# EAGLE design TestAdapter_02 (EAGLE 9.4.2)

## Sheet 1 of 2
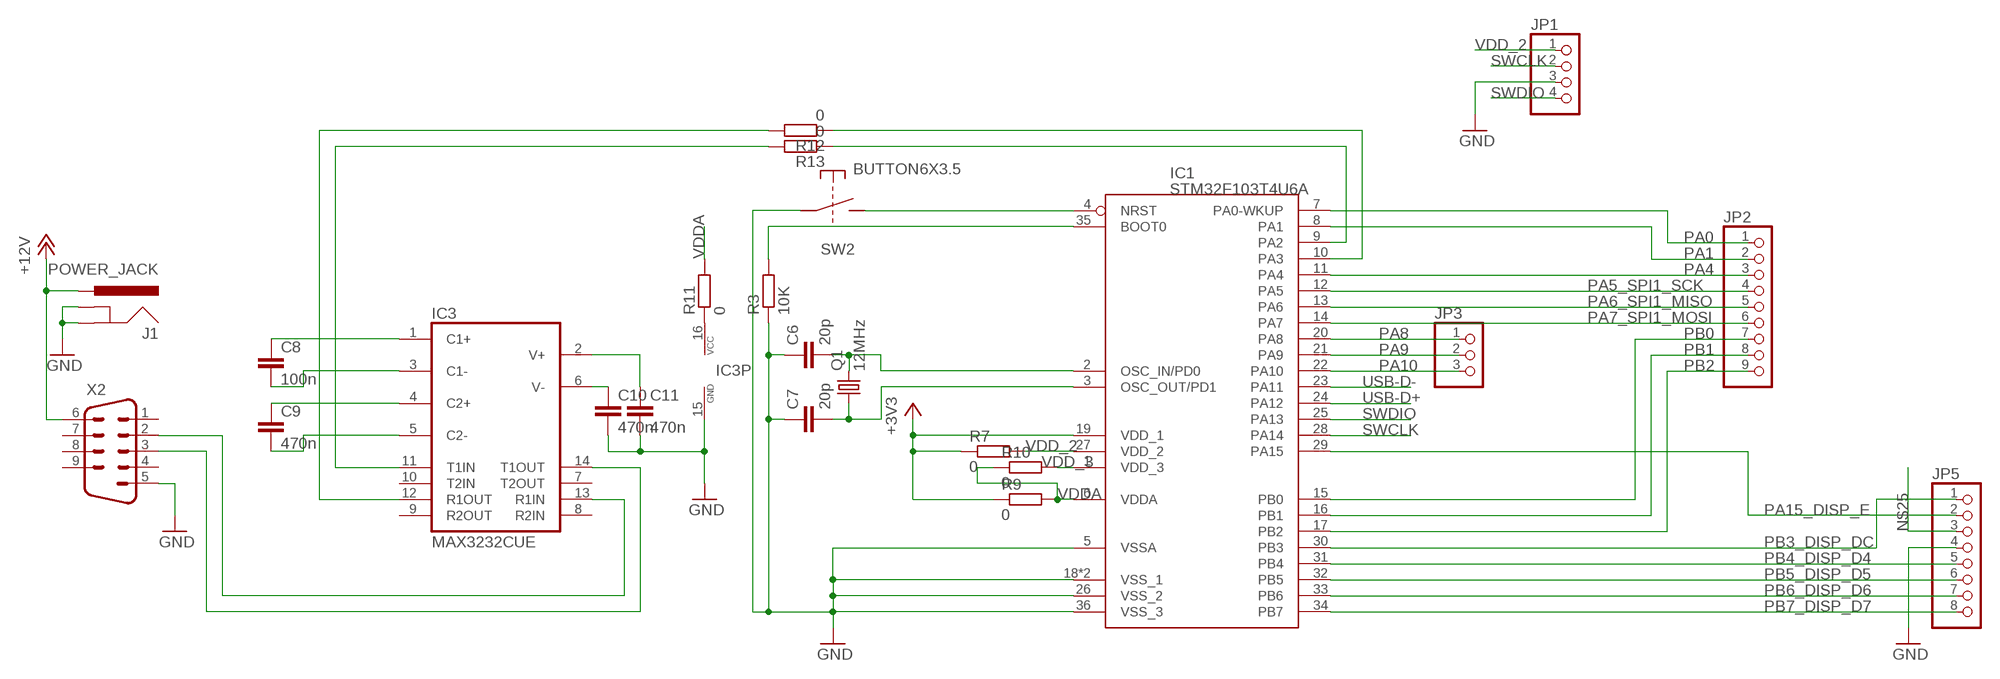
[diagram p0: schematic, sheet 1]

### Parts
C6  20p  CAP_0805  [CAP0805]
C7  20p  CAP_0805  [CAP0805]
C8  100n  CAP_0805  [CAP0805]
C9  470n  CAP_0805  [CAP0805]
C10  470n  CAP_0805  [CAP0805]
C11  470n  CAP_0805  [CAP0805]
IC1  STM32F103T4U6A  [QFN50P606X606X100-36]
IC3  MAX3232CUE  [TSSOP16]
J1  POWER_JACK  [POWER_JACK_PTH]
JP1  PINHD-1X4  [1X04]
JP2  PINHD-1X9  [1X09]
JP3  PINHD-1X3  [1X03]
JP5  PINHD-1X8  [1X08]
Q1  12MHz  CRYSTAL5032  [CRYSTAL-5025]
R3  10K  R_R0805  [RESC2012X50]
R7  0  R_R0805  [RESC2012X50]
R9  0  R_R0805  [RESC2012X50]
R10  0  R_R0805  [RESC2012X50]
R11  0  R_R0805  [RESC2012X50]
R12  0  R_R0805  [RESC2012X50]
R13  0  R_R0805  [RESC2012X50]
SW2  BUTTON6X3.5  [SW-6X3.5]
X2  M09-182  [182-009-MALE]

### Nets
+3V3: IC1.19(VDD_1) R7.1 R9.1 ; also sheet 2
+12V: J1.PWR X2.6
GND: C6.1 C7.1 C10.2 C11.2 IC1.5(VSSA) IC1.18(VSS_1) IC1.26(VSS_2) IC1.36(VSS_3) IC1.P$1(VSS_1) IC3.15(GND) J1.GND J1.GNDBREAK JP1.3 JP5.4 R3.1 SW2.1 X2.5 ; also sheet 2
N$2: C7.2 IC1.3(OSC_OUT/PD1) Q1.P$1
N$3: C6.2 IC1.2(OSC_IN/PD0) Q1.P$2
N$4: IC1.35(BOOT0) R3.2
N$5: IC1.4(NRST) SW2.2
N$6: IC3.16(VCC) R11.1
N$8: IC1.10(PA3) R12.1
N$9: IC1.9(PA2) R13.1
N$16: IC3.11(T1IN) R13.2
N$17: IC3.12(R1OUT) R12.2
N$25: JP5.3 ; also sheet 2
N$27: IC3.14(T1OUT) X2.3
N$28: IC3.13(R1IN) X2.2
N$29: C8.1 IC3.1(C1+)
N$30: C8.2 IC3.3(C1-)
N$31: C9.1 IC3.4(C2+)
N$32: C9.2 IC3.5(C2-)
N$33: C11.1 IC3.2(V+)
N$34: C10.1 IC3.6(V-)
PA0: IC1.7(PA0-WKUP) JP2.1
PA1: IC1.8(PA1) JP2.2
PA4: IC1.11(PA4) JP2.3
PA5_SPI1_SCK: IC1.12(PA5) JP2.4
PA6_SPI1_MISO: IC1.13(PA6) JP2.5
PA7_SPI1_MOSI: IC1.14(PA7) JP2.6
PA8: IC1.20(PA8) JP3.1
PA9: IC1.21(PA9) JP3.2
PA10: IC1.22(PA10) JP3.3
PA15_DISP_E: IC1.29(PA15) JP5.2
PB0: IC1.15(PB0) JP2.7
PB1: IC1.16(PB1) JP2.8
PB2: IC1.17(PB2) JP2.9
PB3_DISP_DC: IC1.30(PB3) JP5.1
PB4_DISP_D4: IC1.31(PB4) JP5.5
PB5_DISP_D5: IC1.32(PB5) JP5.6
PB6_DISP_D6: IC1.33(PB6) JP5.7
PB7_DISP_D7: IC1.34(PB7) JP5.8
SWCLK: IC1.28(PA14) JP1.2
SWDIO: IC1.25(PA13) JP1.4
USB-D+: IC1.24(PA12) ; also sheet 2
USB-D-: IC1.23(PA11) ; also sheet 2
VDD_2: IC1.27(VDD_2) JP1.1 R7.2 ; also sheet 2
VDD_3: IC1.1(VDD_3) R10.2 ; also sheet 2
VDDA: IC1.6(VDDA) R9.2 R10.1 R11.2
Unconnected: IC3.7(T2OUT) IC3.8(R2IN) IC3.9(R2OUT) IC3.10(T2IN) X2.1 X2.4 X2.7 X2.8 X2.9

## Sheet 2 of 2
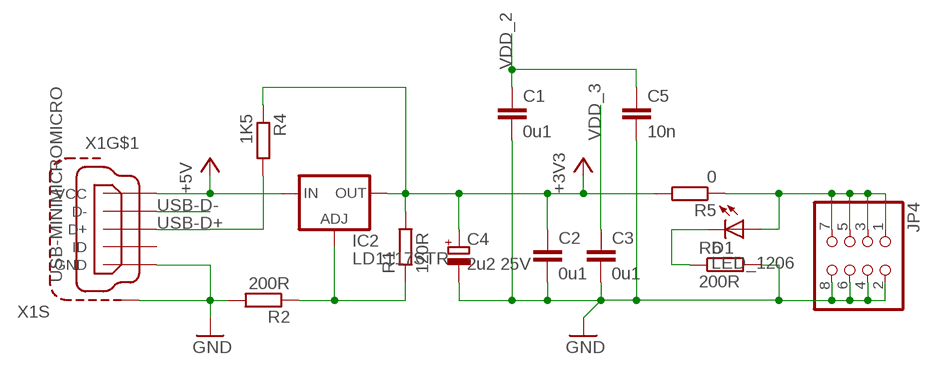
[diagram p1: schematic, sheet 2]

### Parts
C1  0u1  CAP_0805  [CAP0805]
C2  0u1  CAP_0805  [CAP0805]
C3  0u1  CAP_0805  [CAP0805]
C4  2u2 25V  CAP-POL_CAPE3216-A  [CAPMP3317X180]
C5  10n  CAP_0805  [CAP0805]
D1  LED_1206  [LED1206]
IC2  LD1117STR  VREG-ADJLD1117S  [SOT230P700X180-4]
JP4  PINHD-2X4  [2X04]
R1  120R  R_R0805  [RESC2012X50]
R2  200R  R_R0805  [RESC2012X50]
R4  1K5  R_R0805  [RESC2012X50]
R5  0  R_R0805  [RESC2012X50]
R6  200R  R_R0805  [RESC2012X50]
X1  USB-MINIMICROMICRO  [USB-B-MICRO-SMD]

### Nets
+3V3: C2.1 C4.1(+) IC2.2(OUT) IC2.4(OUT) R1.2 R4.1 R5.2 ; also sheet 1
+5V: IC2.3(IN) X1.VBUS(VCC)
GND: C1.2 C2.2 C3.2 C4.2(-) C5.2 JP4.2 JP4.4 JP4.6 JP4.8 R2.2 R6.2 X1.GND X1.SHIELD1(S:S1) X1.SHIELD2(S:S1) X1.SHIELD3(S:S1) ; also sheet 1
N$1: IC2.1(ADJ) R1.1 R2.1
N$25: D1.A JP4.1 JP4.3 JP4.5 JP4.7 R5.1 ; also sheet 1
N$26: D1.C R6.1
USB-D+: R4.2 X1.D+ ; also sheet 1
USB-D-: X1.D- ; also sheet 1
VDD_2: C1.1 C5.1 ; also sheet 1
VDD_3: C3.1 ; also sheet 1
Unconnected: X1.ID

## Library data of the parts
C1-C3 C5-C11 = Flamberm:CAP_
C4 = Flamberm:CAP-POL_
D1 = Flamberm:LED_
IC1 = Flamberm:STM32F103T4U6A
IC2 = Flamberm:VREG-ADJ: VOLTAGE REGULATOR
IC3 = maxim:MAX3232*: True RS-232 Transceivers 3.0V to 5.5V, Low-Power up to 1Mbps, Using Four 0.1µF External Capacitors Source: http://pdfserv.maxim-ic.com/en/ds/MAX3222-MAX3241.pdf; MF: MAXIM; MPN: MAX3232CUE+; OC_FARNELL: 1593350; OC_NEWARK: 68K4629
J1 = SparkFun-Connectors:POWER_JACK: Power Jack Connector This is the standard 5.5mm barrel jack for power. The PTH is the most common, proven, reliable, footprint. The Slot footprint only works if the mill layer is transmitted to the PCB fab house so be warned. Here are the connectors we sell at SparkFun: DC Barrel Power Jack/Connector <https://www.sparkfun.com/products/119> (PRT-00119) DC Barrel Power Jack/Connector (SMD) <https://www.sparkfun.com/products/12748> (PRT-12748) DC Barrel Jack Adapter - Breadboard Compatible <https://www.sparkfun.com/products/10811> (PRT-10811) It is used on this SparkFun product (and many, many others): SparkFun RedBoard - Programmed with Arduino <https://www.sparkfun.com/products/12757> (DEV-12757) Also, if you need a mating power supply or connector, please check these out: Wall Adapter Power Supply - 9VDC 650mA <https://www.sparkfun.com/products/298> (TOL-00298) DC Barrel Jack Adapter - Male <https://www.sparkfun.com/products/10287> (PRT-10287); PROD_ID: CONN-08197
JP1 = pinhead:PINHD-1X4: PIN HEADER
JP2 = pinhead:PINHD-1X9: PIN HEADER
JP3 = pinhead:PINHD-1X3: PIN HEADER
JP4 = pinhead:PINHD-2X4: PIN HEADER
JP5 = pinhead:PINHD-1X8: PIN HEADER
Q1 = Flamberm:CRYSTAL
R1-R7 R9-R13 = Flamberm:R_
SW2 = Flamberm:BUTTON
X1 = Flamberm:USB-MINIMICRO: MINI USB-B Conector Source: www.cypressindustries.com
X2 = con-subd:M09: SUB-D; OC_FARNELL: unknown; OC_NEWARK: unknown

## Board
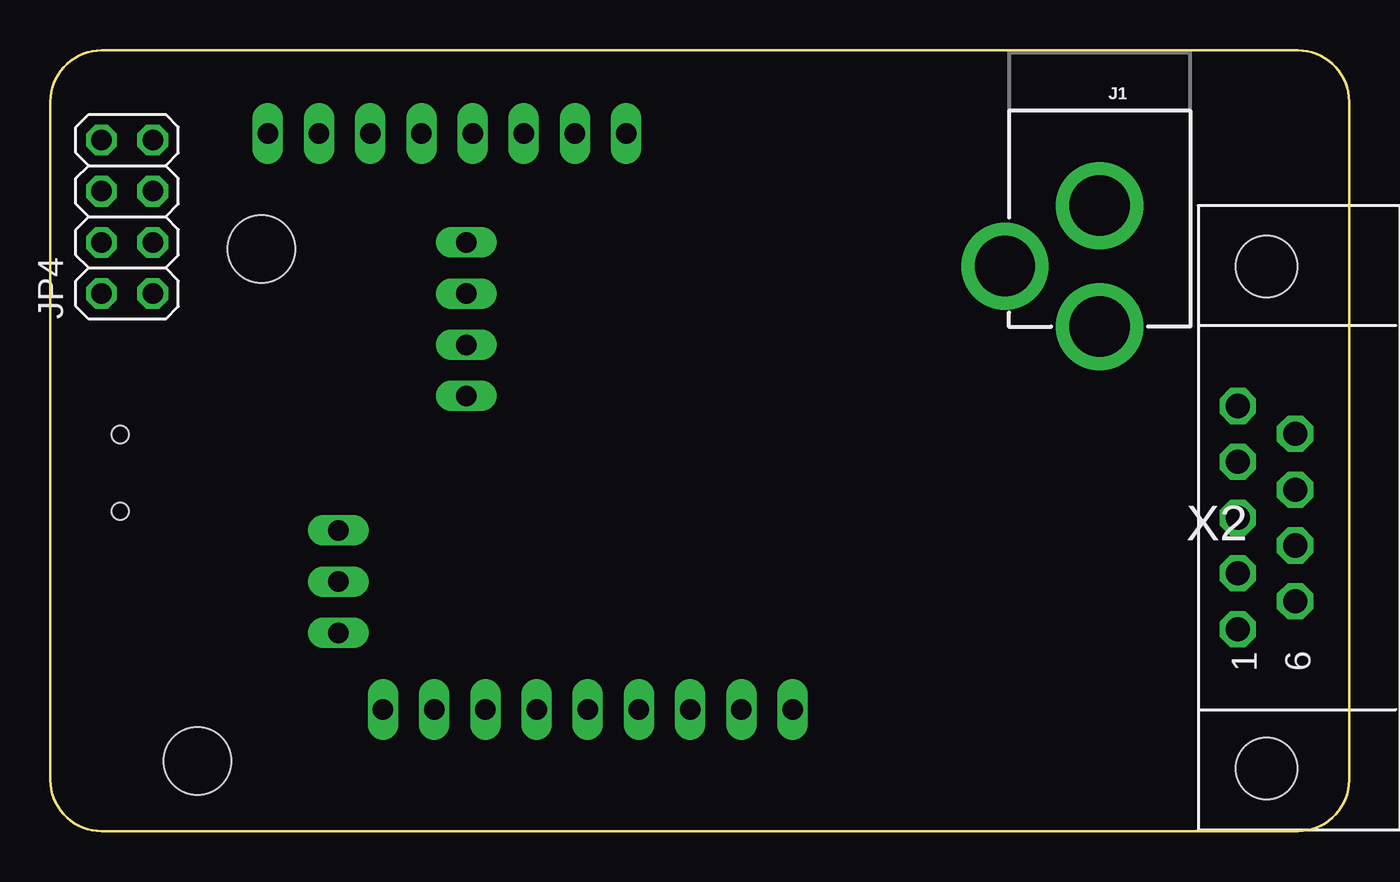
[diagram p2: board, top side]
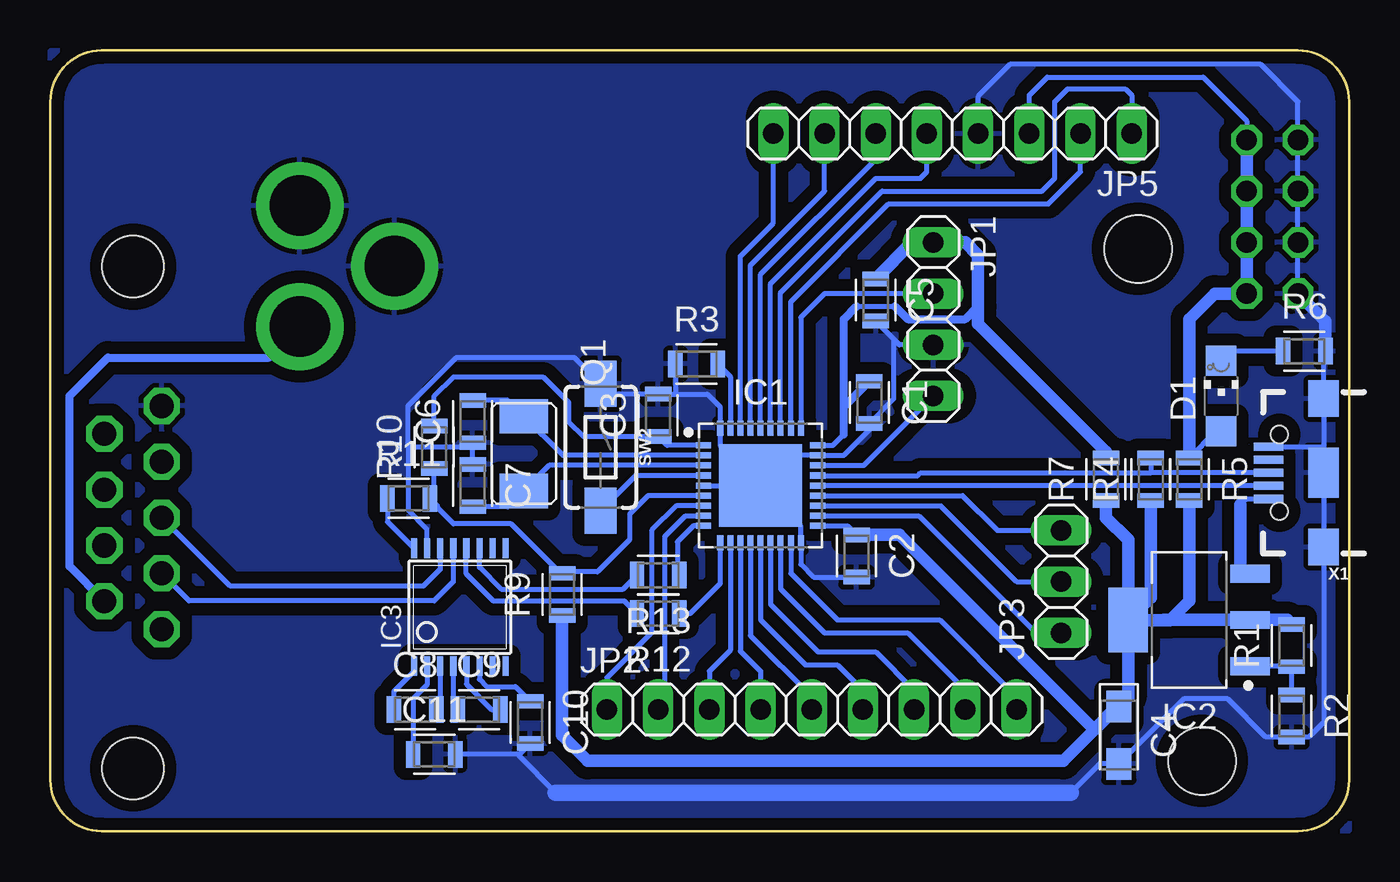
[diagram p3: board, bottom side, seen from below]

Size 64.45 x 38.73 mm. Coordinates in mm from the lower left corner, seen from the top.
Outline: 0,2.54 0,36.2 arc-90 2.54,38.73 61.91,38.73 arc-90 64.45,36.2 64.45,2.54 arc-90 61.91,0 2.54,0 arc-90 0,2.54
Copper layers (1*16): Top 0.035mm / dielectric 1.5mm / Bottom 0.035mm
Design rules "EagleDesignRules *": minimum track width 0.25mm, minimum drill 0.3mm, track to track 0.2mm, track to pad 0.2mm, pad to pad 0.2mm, via to via 0.2mm, smd to smd 0.2mm, copper to edge 0.5mm, drill to drill 0.5mm, minimum pad ring 10mil, minimum via ring 8mil, stop-mask expansion 4mil, vias tented up to drill 0mil, thermal gap 0.25mm
Holes 3.35 mm at 7.3,3.49 10.48,28.89

### Footprints (pad centres in the part's own frame; a part is rotated, then mirrored left to right if it is on the bottom)
CAP0805 = smd 0.712 x 1.312: 1 -1.05,0; 2 1.05,0
CAPMP3317X180 = smd 1.579 x 1.25: 1 -1.425,0; 2 1.425,0
LED1206 = smd 1.5 x 1.5: A 0,-1.75; C 0,1.75
QFN50P606X606X100-36 = smd 0.75 x 0.3: 1 -2.838,2; 2 -2.838,1.5; 3 -2.838,1; 4 -2.838,0.5; 5 -2.838,0; 6 -2.838,-0.5; 7 -2.838,-1; 8 -2.838,-1.5; 9 -2.838,-2; 19 2.838,-2; 20 2.838,-1.5; 21 2.838,-1; 22 2.838,-0.5; 23 2.838,0; 24 2.838,0.5; 25 2.838,1; 26 2.838,1.5; 27 2.838,2 | smd 0.3 x 0.75: 10 -2,-2.838; 11 -1.5,-2.838; 12 -1,-2.838; 13 -0.5,-2.838; 14 0,-2.838; 15 0.5,-2.838; 16 1,-2.838; 17 1.5,-2.838; 18 2,-2.838; 28 2,2.838; 29 1.5,2.838; 30 1,2.838; 31 0.5,2.838; 32 0,2.838; 33 -0.5,2.838; 34 -1,2.838; 35 -1.5,2.838; 36 -2,2.838 | smd 4.1 x 4.1: P$1 0,0
SOT230P700X180-4 = smd 1.965 x 0.889: 1 -3.023,2.3; 2 -3.023,0; 3 -3.023,-2.3 | smd 1.965 x 3.189: 4 3.023,0
TSSOP16 = smd 0.305 x 0.991: 1 -2.275,-2.918; 2 -1.625,-2.918; 3 -0.975,-2.918; 4 -0.325,-2.918; 5 0.325,-2.918; 6 0.975,-2.918; 7 1.625,-2.918; 8 2.275,-2.918; 9 2.275,2.918; 10 1.625,2.918; 11 0.975,2.918; 12 0.325,2.918; 13 -0.325,2.918; 14 -0.975,2.918; 15 -1.625,2.918; 16 -2.275,2.918
POWER_JACK_PTH = drill 2.997 pad 4.318: GND 0,7.7; GNDBREAK 4.7,10.7; PWR 0,13.7
1X04 = drill 1.016 long: 1 -3.81,0; 2 -1.27,0; 3 1.27,0; 4 3.81,0
1X09 = drill 1.016 long: 1 -10.16,0; 2 -7.62,0; 3 -5.08,0; 4 -2.54,0; 5 0,0; 6 2.54,0; 7 5.08,0; 8 7.62,0; 9 10.16,0
1X03 = drill 1.016 long: 1 -2.54,0; 2 0,0; 3 2.54,0
2X04 = drill 1.016 octagon: 1 -3.81,-1.27; 2 -3.81,1.27; 3 -1.27,-1.27; 4 -1.27,1.27; 5 1.27,-1.27; 6 1.27,1.27; 7 3.81,-1.27; 8 3.81,1.27
1X08 = drill 1.016 long: 1 -8.89,0; 2 -6.35,0; 3 -3.81,0; 4 -1.27,0; 5 1.27,0; 6 3.81,0; 7 6.35,0; 8 8.89,0
CRYSTAL-5025 = smd 1.7 x 2.4: P$1 1.85,0; P$2 -1.85,0
RESC2012X50 = smd 0.712 x 1.312: 1 -1.05,0; 2 1.05,0
SW-6X3.5 = smd 2.3 x 1.6: 1 -3.15,0; 2 3.15,0
USB-B-MICRO-SMD = smd 1.45 x 0.4: D+ 2.725,0; D- 2.725,0.65; GND 2.725,-1.3; ID 2.725,-0.65; VBUS 2.725,1.3 | smd 1.5 x 1.8: SHIELD1 0,3.685; SHIELD2 0,-3.685 | smd 1.5 x 2.5: SHIELD3 0,0 | hole 0.85: 2.2,1.9; 2.2,-1.9
182-009-MALE = drill 1.194 pad 1.524 octagon: 1 -5.537,10.923; 2 -2.769,10.923; 3 0,10.923; 4 2.769,10.923; 5 5.537,10.923; 6 -4.153,8.08; 7 -1.384,8.08; 8 1.384,8.08; 9 4.153,8.08 | hole 3.048: -12.446,9.501; 12.446,9.501

### Placement (x,y rotation side)
C1  23.81,21.27 270 bottom
C2  24.45,13.65 270 bottom
C3  34.29,20.64 90 bottom
C4  11.43,4.76 270 bottom
C5  23.5,26.35 270 bottom
C6  43.5,20.32 90 bottom
C7  43.5,17.14 270 bottom
C8  46.35,6.03 0 bottom
C9  43.18,6.03 0 bottom
C10  40.64,5.4 270 bottom
C11  45.4,3.81 0 bottom
D1  6.35,21.59 0 bottom
IC1  29.21,17.14 0 bottom
IC2  7.94,10.48 180 bottom
IC3  44.13,11.11 0 bottom
J1  52.07,38.73 180 top
JP1  20.64,25.4 270 bottom
JP2  26.67,6.03 0 bottom
JP3  14.29,12.38 90 bottom
JP4  3.81,30.48 90 top
JP5  19.68,34.61 180 bottom
Q1  40.96,18.73 270 bottom
R1  2.86,9.21 90 bottom
R2  2.86,5.71 270 bottom
R3  32.38,23.18 0 bottom
R4  9.84,17.46 90 bottom
R5  7.94,17.46 270 bottom
R6  2.22,23.81 0 bottom
R7  12.06,17.46 90 bottom
R9  39.05,11.75 90 bottom
R10  45.4,19.05 90 bottom
R11  46.67,16.51 0 bottom
R12  34.29,10.79 180 bottom
R13  34.29,12.7 180 bottom
SW2  37.15,19.05 270 bottom
X1  1.27,17.78 180 bottom
X2  69.85,15.56 90 top

### Tracks (layer width: path | path; a pad name or v marks a point on that pad's centre or on a via)
+3V3
  Bottom 0.254: 3.08,10.48 R1.2 | IC2.4 10.96,10.47 | 9.2,10.48 9.21,10.47 | IC1.19 24.89,15.14 C2.1
  Bottom 0.61: 3.08,10.48 IC2.2 9.2,10.48 | R4.1 9.84,11.59 10.96,10.47 9.21,10.47 8.9,10.47 7.94,11.43 R5.2 | R9.1 39.05,4.76 37.78,3.49 14.19,3.49 12.65,5.03 | 12.65,5.03 11.49,6.19 C4.1 10.96,6.66 IC2.4 10.96,14.45 12.06,15.56 R7.1 | C2.1 22.32,14.7 12.65,5.03
+5V
  Bottom 0.254: X1.VBUS 5.11,16.48 5.4,16.19 | 5.4,13.26 IC2.3
  Bottom 0.61: 5.4,16.19 5.4,13.26
+12V
  Bottom 0.406: X2.6 63.5,13.13 63.5,21.59 61.59,23.5 53.61,23.5 J1.PWR
GND
  Bottom 0.254: C10.2 41.18,3.81 | 41.18,3.81 C11.2 | 46.71,19.05 46.71,15.94 45.76,14.98 IC3.15 | 46.71,19.05 46.71,21.09 44.31,23.5 38.44,23.5 SW2.1 36.63,21.69 C3.2 33.44,21.69 | 1.27,19.05 X1.SHIELD2 1.27,23.71 R6.2 | 1.27,19.05 X1.SHIELD3 X1.SHIELD1 1.27,5.4 2,4.67 R2.2 4.13,4.67 6.03,6.57 8.2,6.57 C4.2 12.38,3.34 13.81,1.91 | X1.GND 1.3,19.08 1.27,19.05 | 33.44,21.69 31.85,21.69 31.21,21.05 IC1.36 31.21,19.14 29.84,17.78 29.84,17.14 | R3.1 33.44,21.69 | C2.2 26.57,12.6 27.21,13.24 IC1.18 27.21,15.14 IC1.P$1 | C7.1 43.5,19.05 | 43.5,19.05 C6.1 | 43.5,19.05 46.71,19.05 | JP1.3 22.32,24.13 22.59,24.4 | 22.59,24.4 C5.2 | IC1.5 29.84,17.14 | 29.84,17.14 IC1.P$1 | IC1.P$1 29.21,17.46 28.03,18.64 IC1.26 25.07,18.64 23.81,19.91 C1.2 22.59,21.44 22.59,24.4 | 39.37,1.91 41.18,3.71 41.18,3.81 | JP4.2 JP4.4 JP4.6 JP4.8 2.54,36.2 4.39,38.04 16.83,38.04 18.41,36.46 JP5.4
  Bottom 0.61: R6.2 1.17,25.3 JP4.2
  Bottom 0.813: 13.81,1.91 39.37,1.91 | J1.GNDBREAK 47.37,28.19
  pour Bottom (isolate 0.61): 64.45,38.73 2.22,38.73 arc90 0,36.51 0,0 61.91,0 arc90 64.45,2.54
N$1
  Bottom 0.254: R2.1 R1.1 2.88,8.18 IC2.1
N$2
  Bottom 0.254: IC1.3 39.7,18.14 Q1.P$1 41.74,16.09 C7.2
N$3
  Bottom 0.254: IC1.2 39.02,18.64 Q1.P$2 41.74,21.37 C6.2
N$4
  Bottom 0.254: R3.2 30.71,22.55 IC1.35
N$5
  Bottom 0.254: IC1.4 35.4,17.64 SW2.2
N$6
  Bottom 0.254: R11.1 47.72,15.35 IC3.16
N$8
  Bottom 0.254: IC1.10 31.21,12.29 32.7,10.79 R12.1
N$9
  Bottom 0.254: IC1.9 32.54,15.14 33.34,14.35 33.34,12.8 R13.1
N$16
  Bottom 0.254: IC3.11 43.16,13.09 42.08,12.01 36.03,12.01 R13.2
N$17
  Bottom 0.254: IC3.12 43.81,12.76 42.48,11.43 35.98,11.43 R12.2
N$25
  Bottom 0.254: R5.1 6.61,19.84 D1.A | JP5.3 15.88,36.51 14.98,37.41 7.25,37.41 5.08,35.24 JP4.7
  Bottom 0.61: JP4.7 JP4.5 JP4.3 JP4.1 6.67,26.67 7.94,25.4 R5.1
N$26
  Bottom 0.254: R6.1 5.88,23.81 D1.C
N$27
  Bottom 0.254: IC3.14 45.11,12.99 45.95,12.15 55.52,12.15 X2.3
N$28
  Bottom 0.254: IC3.13 44.46,12.38 45.4,11.43 57.57,11.43 X2.2
N$29
  Bottom 0.254: IC3.1 46.41,7.94 47.41,6.94 C8.1
N$30
  Bottom 0.254: IC3.3 45.11,6.23 C8.2
N$31
  Bottom 0.254: IC3.4 44.46,6.26 C9.1
N$32
  Bottom 0.254: IC3.5 43.81,7.29 42.55,6.03 C9.2
N$33
  Bottom 0.254: IC3.2 45.76,7.26 46.45,6.57 C11.1
N$34
  Bottom 0.254: IC3.6 43.16,7.53 42.8,7.18 41.37,7.18 C10.1
PA0
  Bottom 0.254: IC1.7 33.38,16.14 34.61,14.92 34.61,9.84 36.83,7.62 JP2.1
PA1
  Bottom 0.254: IC1.8 32.07,15.62 32.96,15.62 33.97,14.61 33.97,6.35 JP2.2
PA4
  Bottom 0.254: IC1.11 30.71,8.98 31.75,7.94 JP2.3
PA5_SPI1_SCK
  Bottom 0.254: IC1.12 30.21,8.94 29.21,7.94 JP2.4
PA6_SPI1_MISO
  Bottom 0.254: JP2.5 26.67,6.67 29.71,9.71 IC1.13
PA7_SPI1_MOSI
  Bottom 0.254: JP2.6 24.13,6.99 25.4,8.26 26.99,8.26 29.21,10.48 IC1.14
PA8
  Bottom 0.254: IC1.20 21.36,15.64 15.56,9.84 JP3.1
PA9
  Bottom 0.254: IC1.21 20.27,16.14 16.51,12.38 JP3.2
PA10
  Bottom 0.254: IC1.22 19.18,16.64 17.46,14.92 JP3.3
PA15_DISP_E
  Bottom 0.254: IC1.29 27.71,26.27 22.86,31.11 14.92,31.11 13.34,32.7 JP5.2
PB0
  Bottom 0.254: JP2.7 21.59,6.99 23.5,8.89 26.35,8.89 28.71,11.25 IC1.15
PB1
  Bottom 0.254: IC1.16 28.21,12.02 26.04,9.84 21.91,9.84 19.05,6.99 JP2.8
PB2
  Bottom 0.254: IC1.17 27.71,12.79 25.4,10.48 20.32,10.48 16.51,6.67 JP2.9
PB3_DISP_DC
  Bottom 0.254: IC1.30 28.21,26.72 23.18,31.75 15.24,31.75 14.61,32.38 14.61,36.2 13.97,36.83 11.11,36.83 10.79,36.51 JP5.1
PB4_DISP_D4
  Bottom 0.254: IC1.31 28.71,27.17 23.5,32.38 21.27,32.38 20.95,32.7 JP5.5
PB5_DISP_D5
  Bottom 0.254: IC1.32 29.21,27.62 23.5,33.34 JP5.6
PB6_DISP_D6
  Bottom 0.254: IC1.33 29.71,28.07 26.04,31.75 JP5.7
PB7_DISP_D7
  Bottom 0.254: IC1.34 30.21,28.53 28.57,30.16 JP5.8
SWCLK
  Bottom 0.254: JP1.2 26.04,26.67 27.21,25.5 IC1.28
SWDIO
  Bottom 0.254: IC1.25 24.08,18.14 JP1.4
USB-D+
  Bottom 0.254: X1.D+ 9.84,17.78 | R4.2 9.84,17.78 | IC1.24 21.41,17.64 21.27,17.78 9.84,17.78
USB-D-
  Bottom 0.254: IC1.23 10.81,17.14 10.79,17.13 X1.D-
VDD_2
  Bottom 0.254: IC1.27 25.62,19.14 25.08,19.68 | 24.45,26.04 22.54,26.04 | 21.69,29.21 JP1.1
  Bottom 0.406: 25.08,19.68 25.08,21.05 | 25.08,21.05 C1.1 | 25.08,21.05 25.08,25.4 24.45,26.04 | 22.54,26.04 21.91,25.4 19.05,25.4 18.41,26.04
  Bottom 0.61: JP1.1 19.05,29.21 18.41,28.57 18.41,26.04 18.41,25.18 12.06,18.83 R7.2 | C5.1 21.69,29.21
VDD_3
  Bottom 0.254: R10.2 45.4,21.59 44.45,22.54 40.01,22.54 38.73,21.27 38.73,20.32 38,19.59 C3.1 33.85,19.14 IC1.1
VDDA
  Bottom 0.254: R9.2 39.15,12.8 39.21,12.86 | 45.24,16.03 44.45,15.24 41.59,15.24 39.21,12.86 | 45.24,16.03 45.4,16.19 R10.1 | R11.2 45.24,16.13 45.24,16.03 | 39.21,12.86 37.31,12.86 35.7,14.46 35.7,15.73 34.79,16.64 IC1.6